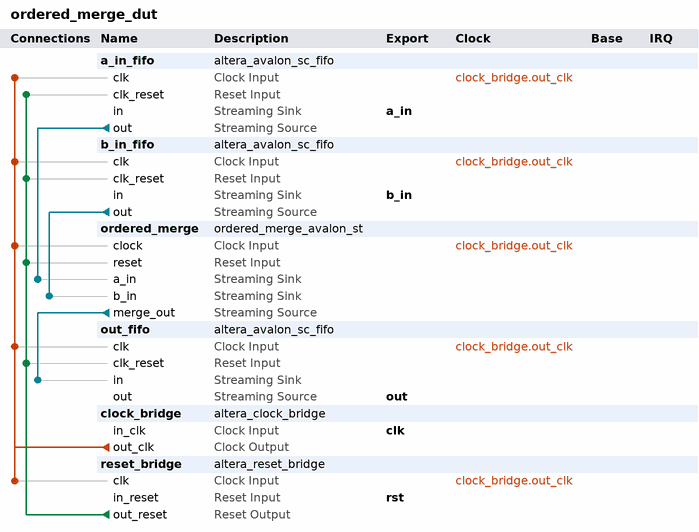
[diagram p0: system contents]
# Platform Designer (Qsys) system ordered_merge_dut, Cyclone V 5CSXFC6C6U23C8ES
# Parameters at their usual value, and those the tool derives, are not listed.
package require -exact qsys 13.1
create_system ordered_merge_dut
set_project_property DEVICE_FAMILY {Cyclone V}
set_project_property DEVICE 5CSXFC6C6U23C8ES

add_instance a_in_fifo altera_avalon_sc_fifo 13.1
set_instance_parameter_value a_in_fifo SYMBOLS_PER_BEAT 8
set_instance_parameter_value a_in_fifo BITS_PER_SYMBOL 1
set_instance_parameter_value a_in_fifo FIFO_DEPTH 16
set_instance_parameter_value a_in_fifo CHANNEL_WIDTH 0
set_instance_parameter_value a_in_fifo ERROR_WIDTH 0
set_instance_parameter_value a_in_fifo USE_PACKETS 1
set_instance_parameter_value a_in_fifo USE_FILL_LEVEL 0
set_instance_parameter_value a_in_fifo USE_MEMORY_BLOCKS 1
set_instance_parameter_value a_in_fifo USE_STORE_FORWARD 0

add_instance b_in_fifo altera_avalon_sc_fifo 13.1
set_instance_parameter_value b_in_fifo SYMBOLS_PER_BEAT 8
set_instance_parameter_value b_in_fifo BITS_PER_SYMBOL 1
set_instance_parameter_value b_in_fifo FIFO_DEPTH 16
set_instance_parameter_value b_in_fifo CHANNEL_WIDTH 0
set_instance_parameter_value b_in_fifo ERROR_WIDTH 0
set_instance_parameter_value b_in_fifo USE_PACKETS 1
set_instance_parameter_value b_in_fifo USE_FILL_LEVEL 0
set_instance_parameter_value b_in_fifo USE_MEMORY_BLOCKS 1
set_instance_parameter_value b_in_fifo USE_STORE_FORWARD 0

add_instance ordered_merge ordered_merge_avalon_st 1.0
set_instance_parameter_value ordered_merge WIDTH 8
set_instance_parameter_value ordered_merge SEND_ENDOFPACKET 1
set_instance_parameter_value ordered_merge END_PACKET_VALUE 0

add_instance out_fifo altera_avalon_sc_fifo 13.1
set_instance_parameter_value out_fifo SYMBOLS_PER_BEAT 8
set_instance_parameter_value out_fifo BITS_PER_SYMBOL 1
set_instance_parameter_value out_fifo FIFO_DEPTH 16
set_instance_parameter_value out_fifo CHANNEL_WIDTH 0
set_instance_parameter_value out_fifo ERROR_WIDTH 0
set_instance_parameter_value out_fifo USE_PACKETS 1
set_instance_parameter_value out_fifo USE_FILL_LEVEL 0
set_instance_parameter_value out_fifo USE_MEMORY_BLOCKS 1
set_instance_parameter_value out_fifo USE_STORE_FORWARD 0

add_instance clock_bridge altera_clock_bridge 13.1
set_instance_parameter_value clock_bridge DERIVED_CLOCK_RATE 0
set_instance_parameter_value clock_bridge EXPLICIT_CLOCK_RATE 0

add_instance reset_bridge altera_reset_bridge 13.1
set_instance_parameter_value reset_bridge ACTIVE_LOW_RESET 0
set_instance_parameter_value reset_bridge SYNCHRONOUS_EDGES deassert

# connections
add_connection clock_bridge.out_clk a_in_fifo.clk clock
add_connection clock_bridge.out_clk b_in_fifo.clk clock
add_connection clock_bridge.out_clk ordered_merge.clock clock
add_connection clock_bridge.out_clk out_fifo.clk clock
add_connection clock_bridge.out_clk reset_bridge.clk clock
add_connection reset_bridge.out_reset a_in_fifo.clk_reset reset
add_connection reset_bridge.out_reset b_in_fifo.clk_reset reset
add_connection reset_bridge.out_reset ordered_merge.reset reset
add_connection reset_bridge.out_reset out_fifo.clk_reset reset
add_connection a_in_fifo.out ordered_merge.a_in avalon_streaming
add_connection b_in_fifo.out ordered_merge.b_in avalon_streaming
add_connection ordered_merge.merge_out out_fifo.in avalon_streaming

# exported interfaces
add_interface clk clock sink
set_interface_property clk EXPORT_OF clock_bridge.in_clk
add_interface rst reset sink
set_interface_property rst EXPORT_OF reset_bridge.in_reset
add_interface a_in avalon_streaming sink
set_interface_property a_in EXPORT_OF a_in_fifo.in
add_interface b_in avalon_streaming sink
set_interface_property b_in EXPORT_OF b_in_fifo.in
add_interface out avalon_streaming source
set_interface_property out EXPORT_OF out_fifo.out

set_interconnect_requirement {$system} qsys_mm.clockCrossingAdapter HANDSHAKE
set_interconnect_requirement {$system} qsys_mm.maxAdditionalLatency 1
set_interconnect_requirement {$system} qsys_mm.insertDefaultSlave false

save_system ordered_merge_dut.qsys
